# Altium schematic sheet Digital IO HS.SchDoc
size 297 x 209 mm; CompanyName: Sainsbury Wellcome Centre; Organization: FabLab; Address1: Sainsbury Wellcome Centre; Address2: 25 Howland Street; Address3: London; Address4: W1T 4JG; DocumentNumber: 7; SheetNumber: 7; SheetTotal: 12; swcgroup: FabLab; Org: Sainsbury Wellcome Centre; Add1: 25 Howland Street; Add2: London; Add3: W1T 4JG; WebAddress: www.sainsburywellcome.org; SheetSize: A4; SheetName: Level Shifter
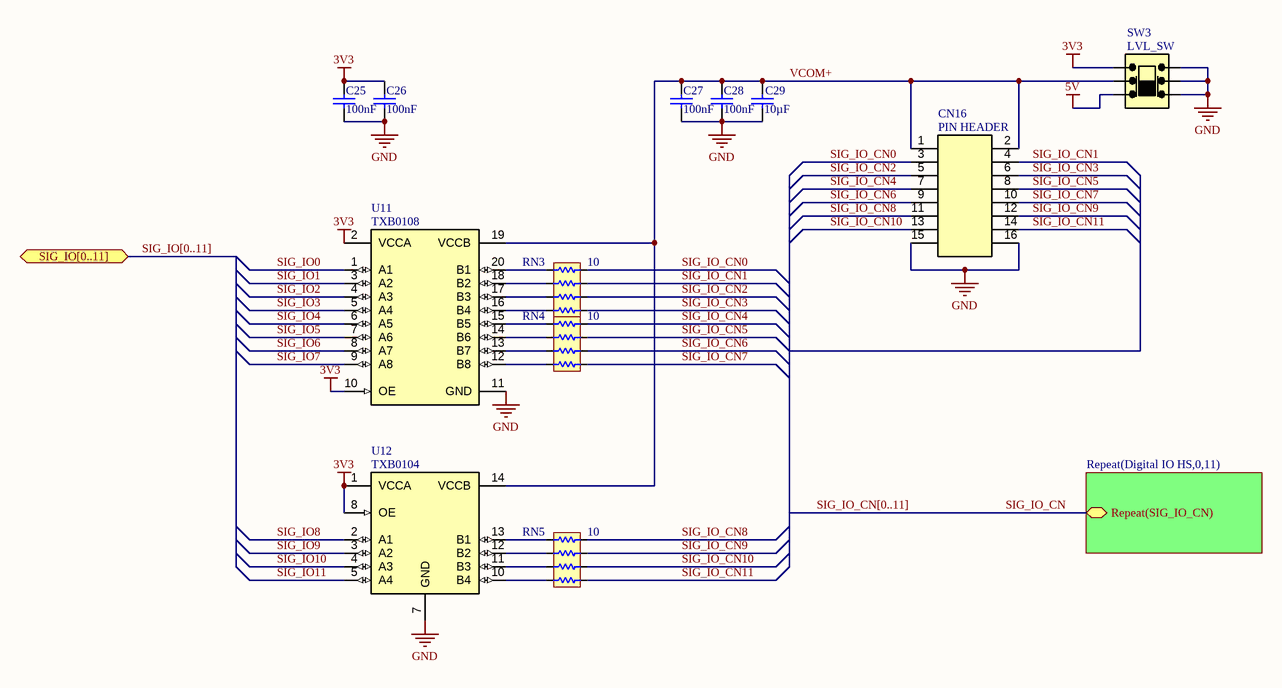
[diagram p0: Digital IO HS.SchDoc]

## Parts
C25  value 100nF  [CAP_CHIP_0603]  (hidden comment: C0603-100nF-50V)
C26  value 100nF  [CAP_CHIP_0603]  (hidden comment: C0603-100nF-50V)
C27  value 100nF  [CAP_CHIP_0603]  (hidden comment: C0603-100nF-50V)
C28  value 100nF  [CAP_CHIP_0603]  (hidden comment: C0603-100nF-50V)
C29  value 10µF  [CAP_CHIP_0603]  (hidden comment: C0603-10uF-35V)
CN16  PIN HEADER  [PIN_2.54_2X8P]
RN3  value 10  [RES_ARRAY_0603]  (hidden comment: RN0603-10R)
RN4  value 10  [RES_ARRAY_0603]  (hidden comment: RN0603-10R)
RN5  value 10  [RES_ARRAY_0603]  (hidden comment: RN0603-10R)
SW3  LVL_SW  [SW_SLIDE_OS202013MT8]
U11  TXB0108  [TSSOP20_6.5X4.4_0.65E]
U12  TXB0104  [TSSOP14_5X4.4_0.65E]

## Sub-sheets
Repeat(Digital IO HS,0,11) = Digital IO Connector.SchDoc: Repeat(SIG_IO_CN) (bidir)

## Ports
SIG_IO[0..11] (bidir)

## Nets
3V3: C25.2 C26.2 SW3.3(NOA) U11.2(VCCA) U11.10(OE) U12.1(VCCA) U12.8(OE)
5V: SW3.1(NCA)
GND: C25.1 C26.1 C27.1 C28.1 C29.1 CN16.15 CN16.16 SW3.4(NCB) SW3.5(COMB) SW3.6(NOB) U11.11(GND) U12.7(GND)
SIG_IO0: U11.1(A1)
SIG_IO1: U11.3(A2)
SIG_IO2: U11.4(A3)
SIG_IO3: U11.5(A4)
SIG_IO4: U11.6(A5)
SIG_IO5: U11.7(A6)
SIG_IO6: U11.8(A7)
SIG_IO7: U11.9(A8)
SIG_IO8: U12.2(A1)
SIG_IO9: U12.3(A2)
SIG_IO10: U12.4(A3)
SIG_IO11: U12.5(A4)
SIG_IO_CN: sheet Repeat(Digital IO HS,0,11)/Repeat(SIG_IO_CN)
SIG_IO_CN0: CN16.3 RN3.8
SIG_IO_CN1: CN16.4 RN3.7
SIG_IO_CN2: CN16.5 RN3.6
SIG_IO_CN3: CN16.6 RN3.5
SIG_IO_CN4: CN16.7 RN4.8
SIG_IO_CN5: CN16.8 RN4.7
SIG_IO_CN6: CN16.9 RN4.6
SIG_IO_CN7: CN16.10 RN4.5
SIG_IO_CN8: CN16.11 RN5.8
SIG_IO_CN9: CN16.12 RN5.7
SIG_IO_CN10: CN16.13 RN5.6
SIG_IO_CN11: CN16.14 RN5.5
VCOM+: C27.2 C28.2 C29.2 CN16.1 CN16.2 SW3.2(COMA) U11.19(VCCB) U12.14(VCCB)
NetRN3_1: RN3.1 U11.20(B1)
NetRN3_2: RN3.2 U11.18(B2)
NetRN3_3: RN3.3 U11.17(B3)
NetRN3_4: RN3.4 U11.16(B4)
NetRN4_1: RN4.1 U11.15(B5)
NetRN4_2: RN4.2 U11.14(B6)
NetRN4_3: RN4.3 U11.13(B7)
NetRN4_4: RN4.4 U11.12(B8)
NetRN5_1: RN5.1 U12.13(B1)
NetRN5_2: RN5.2 U12.12(B2)
NetRN5_3: RN5.3 U12.11(B3)
NetRN5_4: RN5.4 U12.10(B4)

## Buses and harness runs
bus SIG_IO[0..11] = port SIG_IO[0..11]
bus SIG_IO_CN[0..11]

## Notes on the sheet
- FILE
- VARIANT
- DATE
- REVISION
- SHEET
- /
- PROJECT
- SIZE

## Library data of the parts
C25-C28 = CMP-611-0027-24: 0603 Multilayer Ceramic Capacitors MLCC; PartNumber: CC0603KRX7R9BB104; Tolerance: 10%; Pick&PlaceFootprint: C0603; Dielectric: X7R; Voltage Rating: 50V; Capacitor Type: Ceramic; RoHS: Yes; Mount: SMD; LCSC Part N.: C14663; Case/Package: 0603
C29 = CMP-611-0048-3: Ceramic Capacitor, Multilayer, Ceramic, 35V, 20% +Tol, 20% -Tol, X5R, 15% TC, 10uF, Surface Mount, 0603; PartNumber: GRM188R6YA106MA73D; Pick&PlaceFootprint: C0603; Dielectric: X5R; Capacitor Type: Ceramic; Mount: SMD; LCSC Part N.: C194427; RoHS: Yes; Tolerance: 20%; Voltage Rating: 35V; Case/Package: 0603
CN16 = CMP-380-0031-5: Straight Policy 2.5mm 6mm -40℃~+105℃ 3mm 2.54mm Double Row Black Brass 2.54mm Plugin,P=2.54mm Pin Headers; PartNumber: PZ254V-12-16P; Number of Contacts: 16; Gender: Male; Number of Positions: 8; Mount: Through Hole; Pitch: 2.54mm; Number of Rows: 2; LCSC Part N.: C492425; Orientation: Straight
RN3-RN5 = CMP-633-0183-1: Array/Network Resistor, Jumper, Metal Glaze/thick Film, 10ohm, 50V, 5% +/-Tol, -200,200ppm/Cel, Surface Mount, 1206; PartNumber: 4D03WGJ0100T5E; Element Power Dissipation: 62.5mW; Number of Resistors: 4; Pick&PlaceFootprint: R0603x4; LCSC Part N.: C11993; Voltage Rating: 50V; Power Rating: 62.5mW; Tolerance: 5%; Case/Package: 0612; Mount: SMD; RoHS: Yes
SW3 = CMP-B00-0028-1: Switch Slide ON ON DPDT Top Slide 0.3A 30VDC 10000Cycles PC Pins Thru-Hole Bulk; PartNumber: OS202013MT8QN1; Switch Travel: 3.2mm; Switch Function: On-On; Voltage Rating (DC): 30V; Throw Configuration: DPDT; Orientation: Straight; LCSC Part N.: C2799227
U11 = CMP-950-0024-1: 8-Bit Bidirectional Voltage-Level Shifter with Auto Direction Sensing and +/-15-kV ESD Protect 20-TSSOP -40 to 85; PartNumber: TXB0108PWR; Data Rate: 100Mbps; Output Type: 3-STATE; Number of Channels: 8; Min Supply Voltage: 1.2V; Max Supply Voltage: 5.5V; Propagation Delay: 4ns; Channel Type: Bidirectional; LCSC Part N.: C53406
U12 = CMP-950-0006-5: 4-Bit Bidirectional Voltage-Level Shifter with Auto Direction Sensing and +/-15 kV ESD Protect 14-TSSOP -40 to 85; Max Supply Voltage: 5.5V; Min Supply Voltage: 1.2V; Propagation Delay: 31ns; LCSC Part N.: C60708; Channel Type: Bidirectional; PartNumber: TXB0104PWR